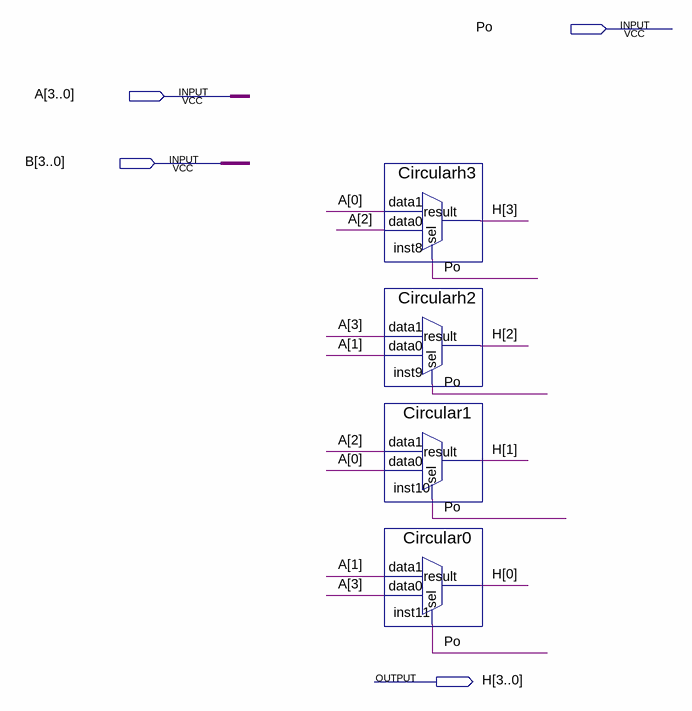
[diagram p0: schematic sheet]
// Quartus schematic ShiftUnit.bdf as structural Verilog: 4 symbols, 4 pins
module ShiftUnit (
  input  Po,
  input  [3:0] A,
  input  [3:0] B,
  output [3:0] H
);

  Circularh3 inst8 (.data1(A[0]), .data0(A[2]), .sel(Po), .result(H[3]));
  Circularh2 inst9 (.data1(A[3]), .data0(A[1]), .sel(Po), .result(H[2]));
  Circular1 inst10 (.data1(A[2]), .data0(A[0]), .sel(Po), .result(H[1]));
  Circular0 inst11 (.data1(A[1]), .data0(A[3]), .sel(Po), .result(H[0]));
endmodule
